# EAGLE design Updated_Schematic_11-13 (EAGLE 9.5.1)
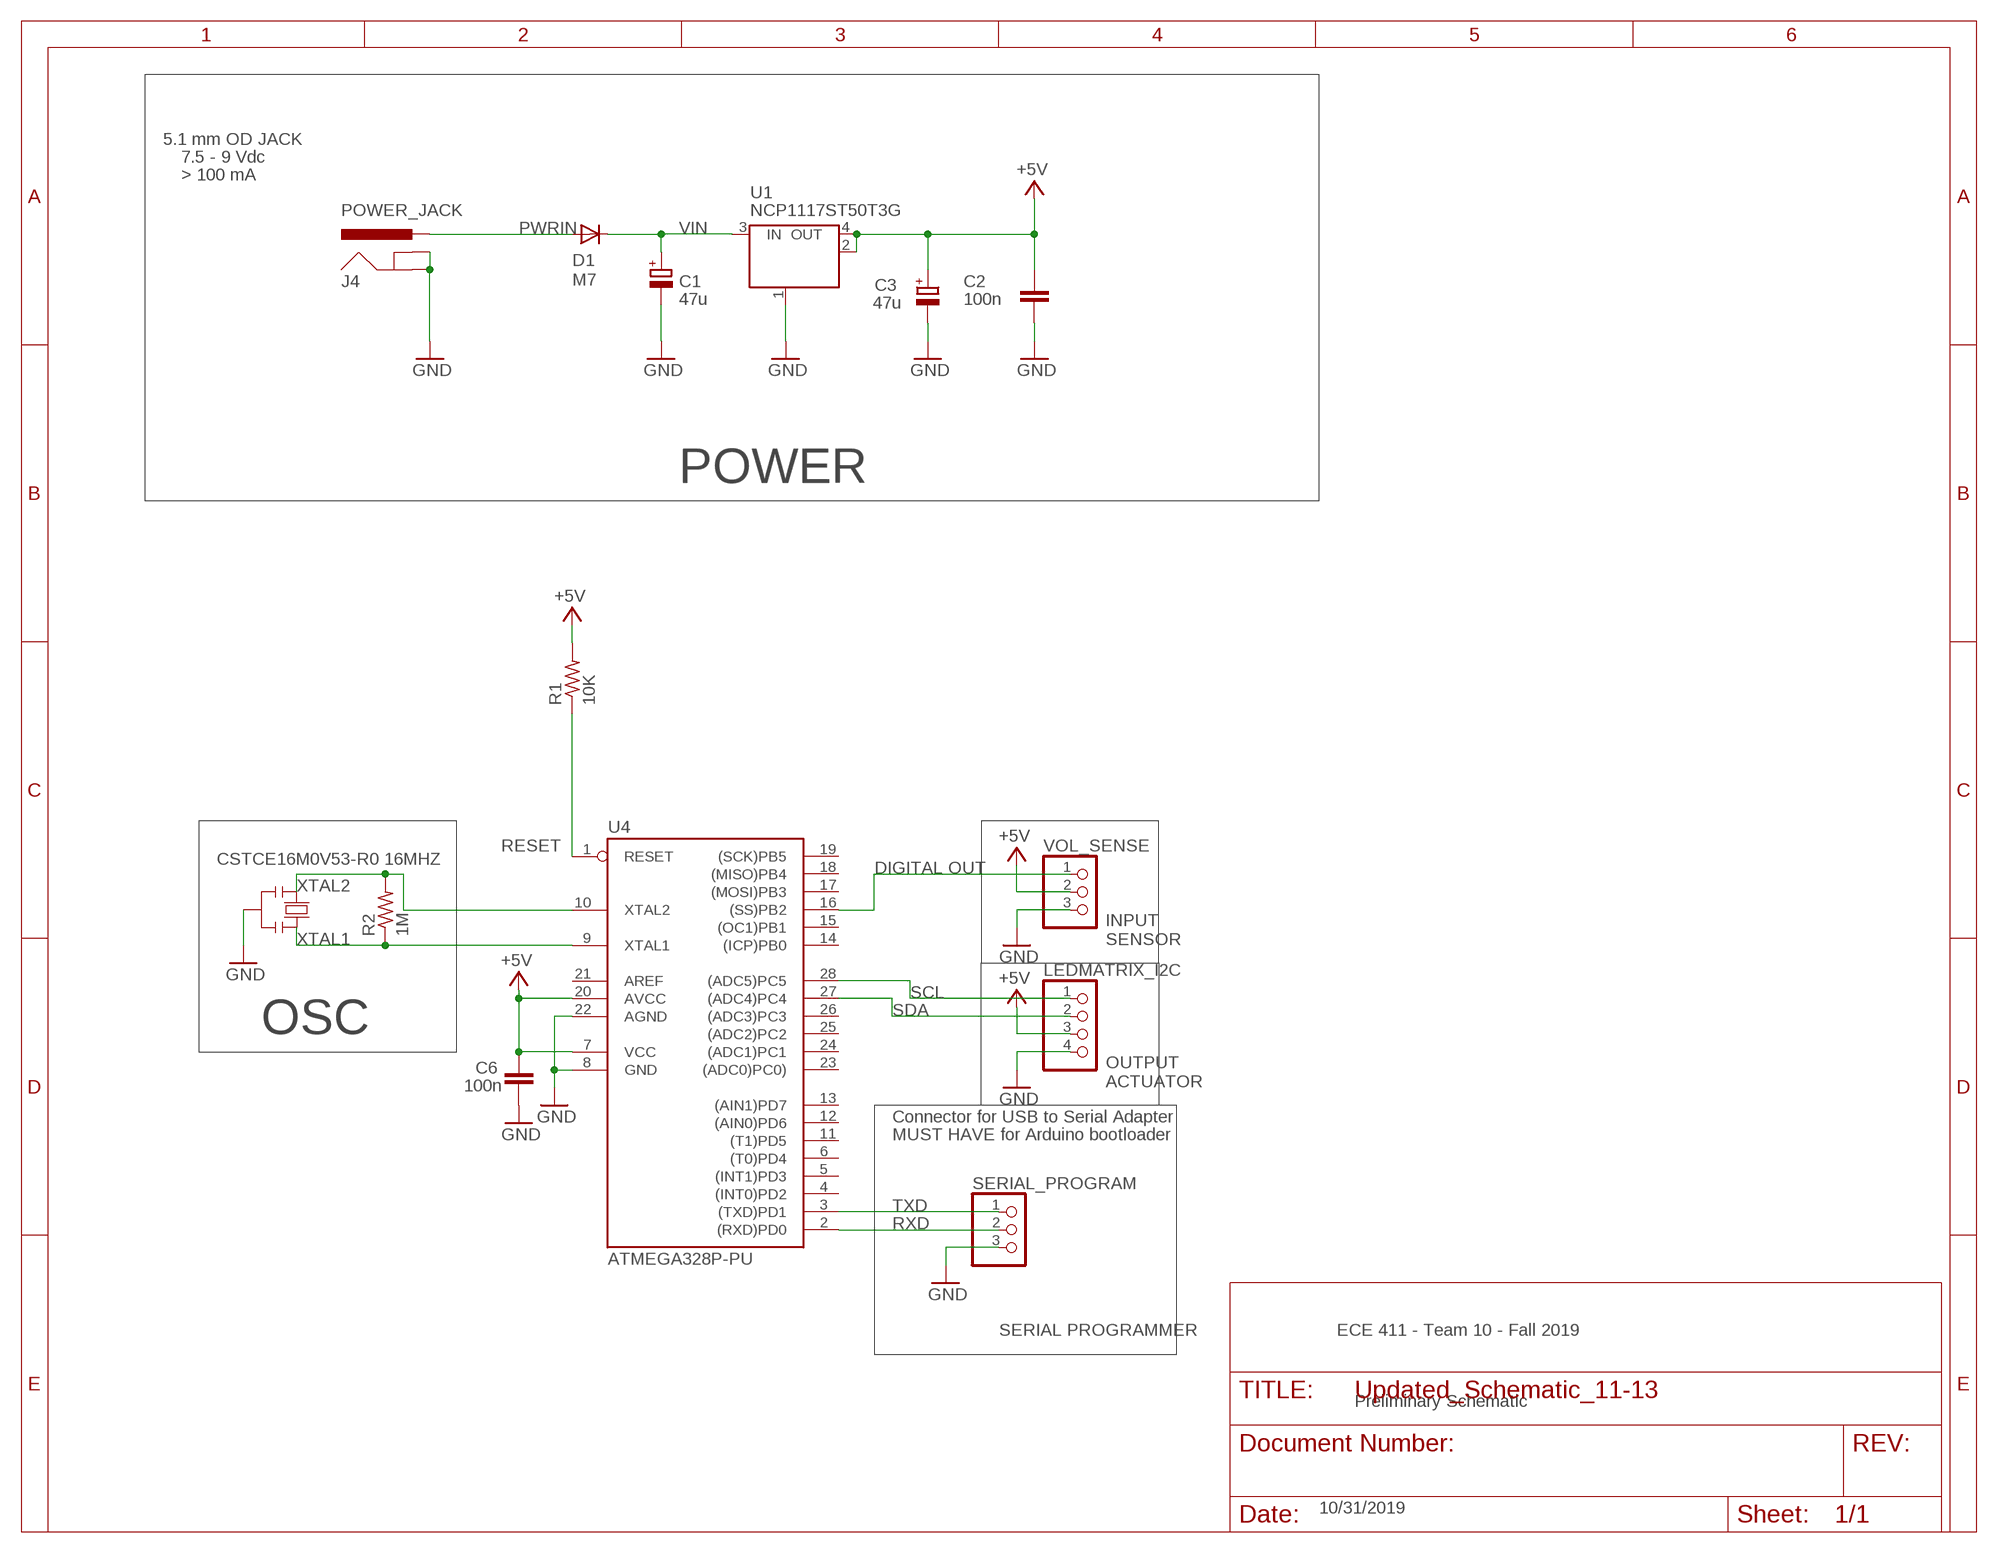
[diagram p0: schematic, sheet 1]

## Parts
C1  47u  CPOL-EUD  [PANASONIC_D]
C2  100n  C-EUC0805  [C0805]
C3  47u  CPOL-EUD  [PANASONIC_D]
C6  100n  C-EUC0805  [C0805]
D1  M7  DIODE-SMB  [SMB]
J4  POWER_JACK  [POWER_JACK_PTH]
LEDMATRIX_I2C  PINHD-1X4  [1X04]
R1  10K  R-US_R0805  [R0805]
R2  1M  R-US_R0805  [R0805]
SERIAL_PROGRAM  PINHD-1X3  [1X03]
U1  NCP1117ST50T3G  MC33269ST-3.3T3  [SOT223]
U4  ATMEGA328P-PU  [DIL28-3]
VOL_SENSE  PINHD-1X3  [1X03]
X1  CSTCE16M0V53-R0 16MHZ  RESONATORMU  [RESONATOR]

## Nets
+5V [usbvcc]: C2.2 C3.+ C6.2 LEDMATRIX_I2C.3 R1.2 U1.2(OUT) U1.4(OUT) U4.7(VCC) U4.20(AVCC) VOL_SENSE.2
GND [gnd]: C1.- C2.1 C3.- C6.1 J4.GND J4.GNDBREAK LEDMATRIX_I2C.4 SERIAL_PROGRAM.3 U1.1(GND/ADJ) U4.8(GND) U4.22(AGND) VOL_SENSE.3 X1.2
N$3: U4.16((SS)PB2) VOL_SENSE.1
PWRIN [power]: D1.A J4.PWR
RESET: R1.1 U4.1(RESET)
RXD: SERIAL_PROGRAM.2 U4.2((RXD)PD0)
SCL: LEDMATRIX_I2C.1 U4.28((ADC5)PC5)
SDA: LEDMATRIX_I2C.2 U4.27((ADC4)PC4)
TXD: SERIAL_PROGRAM.1 U4.3((TXD)PD1)
VIN [power]: C1.+ D1.C U1.3(IN)
XTAL1: R2.1 U4.9(XTAL1) X1.3
XTAL2: R2.2 U4.10(XTAL2) X1.1
Unconnected: U4.4((INT0)PD2) U4.5((INT1)PD3) U4.6((T0)PD4) U4.11((T1)PD5) U4.12((AIN0)PD6) U4.13((AIN1)PD7) U4.14((ICP)PB0) U4.15((OC1)PB1) U4.17((MOSI)PB3) U4.18((MISO)PB4) U4.19((SCK)PB5) U4.21(AREF) U4.23((ADC0)PC0)) U4.24((ADC1)PC1) U4.25((ADC2)PC2) U4.26((ADC3)PC3)

## Notes on the sheet
- 5.1 mm OD JACK
- 7.5 - 9 Vdc
- > 100 mA
- POWER
- DIGITAL OUT
- INPUT 
  SENSOR
- OSC
- OUTPUT
  ACTUATOR
- Connector for USB to Serial Adapter
- MUST HAVE for Arduino bootloader
- SERIAL PROGRAMMER | ECE 411 - Team 10 - Fall 2019
- Preliminary Schematic
- 10/31/2019

## Library data of the parts
C1 C3 = rcl:CPOL-EU: POLARIZED CAPACITOR, European symbol
C2 C6 = rcl:C-EU: CAPACITOR, European symbol
D1 = diode:DIODE-: DIODE
J4 = SparkFun-Connectors:POWER_JACK: Power Jack Connector This is the standard 5.5mm barrel jack for power. The PTH is the most common, proven, reliable, footprint. The Slot footprint only works if the mill layer is transmitted to the PCB fab house so be warned. Here are the connectors we sell at SparkFun: DC Barrel Power Jack/Connector <https://www.sparkfun.com/products/119> (PRT-00119) DC Barrel Power Jack/Connector (SMD) <https://www.sparkfun.com/products/12748> (PRT-12748) DC Barrel Jack Adapter - Breadboard Compatible <https://www.sparkfun.com/products/10811> (PRT-10811) It is used on this SparkFun product (and many, many others): SparkFun RedBoard - Programmed with Arduino <https://www.sparkfun.com/products/12757> (DEV-12757) Also, if you need a mating power supply or connector, please check these out: Wall Adapter Power Supply - 9VDC 650mA <https://www.sparkfun.com/products/298> (TOL-00298) DC Barrel Jack Adapter - Male <https://www.sparkfun.com/products/10287> (PRT-10287); PROD_ID: CONN-08197
LEDMATRIX_I2C = pinhead:PINHD-1X4: PIN HEADER
R1 R2 = rcl:R-US_: RESISTOR, American symbol
SERIAL_PROGRAM VOL_SENSE = pinhead:PINHD-1X3: PIN HEADER
U1 = linear:MC33269ST*: Adjustable Output Low Dropout Voltage Regulator 800 mA Source: http://www.onsemi.com/pub/Collateral/MC33269-D.PDF
U4 = SmartPrj:ATMEGA328P-: MICROCONTROLLER 4 Kbytes FLASH 128 bytes SRAM 256 bytes EEPROM UART 6-channel 10 bit ADC
X1 = SmartPrj:RESONATOR

## Net classes
0 default: width 0.254 mm, clearance 0.254 mm
1 power: width 0.61 mm, drill 0.61 mm, clearance 0.254 mm
2 gnd: width 0.305 mm, drill 0.559 mm, clearance 0.254 mm
3 usbvcc: width 0.508 mm, drill 0.61 mm, clearance 0.254 mm
4 aref: width 0.406 mm, drill 0.61 mm, clearance 0.254 mm

## Board
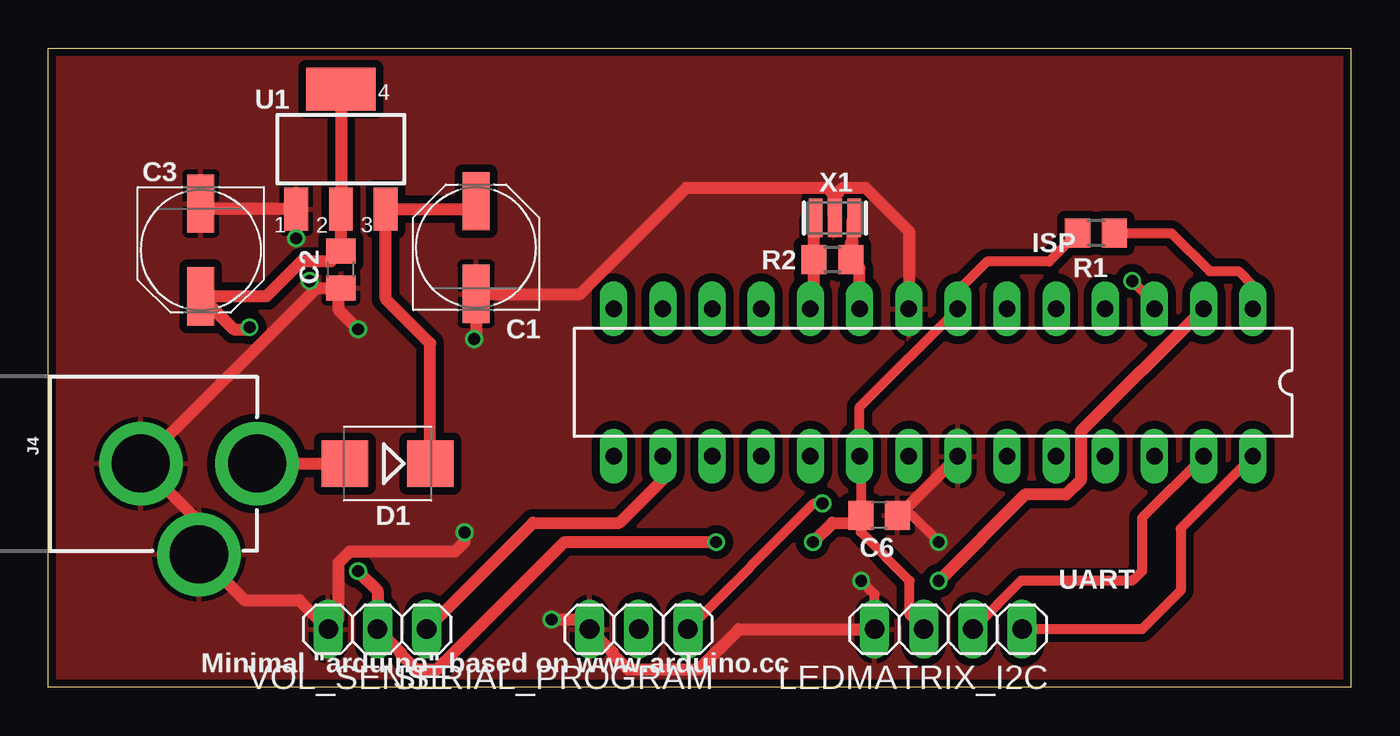
[diagram p1: board, top side]
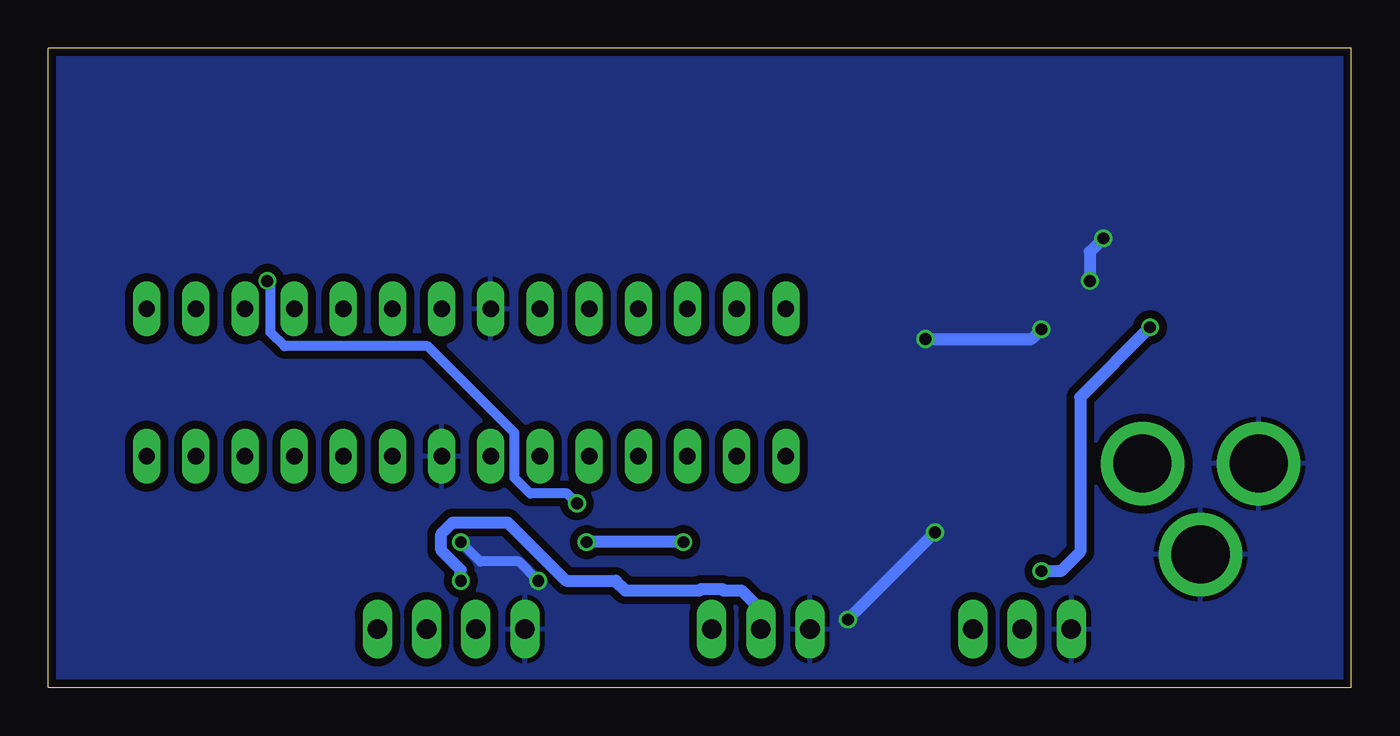
[diagram p2: board, bottom side, seen from below]

Size 67.31 x 33.02 mm. Coordinates in mm from the lower left corner, seen from the top.
Outline: 0,0 0,33.02 67.31,33.02 67.31,0 0,0
Copper layers (1*16): Top 0.035559375mm / dielectric 1.6mm / Bottom 0.035559375mm
Design rules "oshpark-2layer": minimum track width 6mil, minimum drill 10mil, track to track 6mil, track to pad 6mil, pad to pad 6mil, via to via 6mil, smd to smd 6mil, copper to edge 15mil, drill to drill 6mil, minimum pad ring 5mil, minimum via ring 5mil, stop-mask expansion 2.5mil, vias tented up to drill 0mil, thermal gap 10mil

### Footprints (pad centres in the part's own frame; a part is rotated, then mirrored left to right if it is on the bottom)
PANASONIC_D = smd 3 x 1.4: + 2.4,0; - -2.4,0
C0805 = smd 1.3 x 1.5: 1 -0.95,0; 2 0.95,0
SMB = smd 2.4 x 2.4: A 2.2,0; C -2.2,0
POWER_JACK_PTH = drill 2.997 pad 4.318: GND 0,7.7; GNDBREAK 4.7,10.7; PWR 0,13.7
1X04 = drill 1.016 long: 1 -3.81,0; 2 -1.27,0; 3 1.27,0; 4 3.81,0
R0805 = smd 1.3 x 1.5: 1 -0.95,0; 2 0.95,0
1X03 = drill 1.016 long: 1 -2.54,0; 2 0,0; 3 2.54,0
SOT223 = smd 1.219 x 2.235: 1 -2.311,-3.099; 2 0,-3.099; 3 2.311,-3.099 | smd 3.6 x 2.2: 4 0,3.099
DIL28-3 = drill 0.85 pad 1.422 long: 1 -16.51,-3.81; 2 -13.97,-3.81; 3 -11.43,-3.81; 4 -8.89,-3.81; 5 -6.35,-3.81; 6 -3.81,-3.81; 7 -1.27,-3.81; 8 1.27,-3.81; 9 3.81,-3.81; 10 6.35,-3.81; 11 8.89,-3.81; 12 11.43,-3.81; 13 13.97,-3.81; 14 16.51,-3.81; 15 16.51,3.81; 16 13.97,3.81; 17 11.43,3.81; 18 8.89,3.81; 19 6.35,3.81; 20 3.81,3.81; 21 1.27,3.81; 22 -1.27,3.81; 23 -3.81,3.81; 24 -6.35,3.81; 25 -8.89,3.81; 26 -11.43,3.81; 27 -13.97,3.81; 28 -16.51,3.81
RESONATOR = smd 0.7 x 2: 1 -1,0; 2 0,0; 3 1,0

### Placement (x,y rotation side)
C1  22.1,22.73 90 top
C2  15.11,21.59 90 top
C3  7.87,22.61 270 top
C6  42.93,8.89 180 top
D1  17.53,11.56 180 top
J4  -2.92,11.56 270 top
LEDMATRIX_I2C  46.5,3 180 top
R1  54.13,23.47 180 top
R2  40.51,22.1 180 top
SERIAL_PROGRAM  30.5,3 180 top
U1  15.11,27.81 0 top
U4  45.72,15.75 180 top
VOL_SENSE  17,3 180 top
X1  40.64,24.26 0 top

### Tracks (layer width: path | path; a pad name or v marks a point on that pad's centre or on a via)
+5V  (via drill 0.61)
  Top 0.508: R1.2 51.7,22 48.5,22 46.99,20.49 U4.7 41.91,14.48 U4.20 41.98,11.87 C6.2 41.98,8.5 41.98,8.02 44.5,5.5 44.5,3.73 LEDMATRIX_I2C.3
  Top 0.61: U1.4 15.11,25.61 15,25.5 15,24.83 U1.2 C2.2 14.59,22.02 13.08,22.02 11.27,20.21 C3.+ 9.58,18.5 10.29,18.5 v10.39,18.61 | v16,6 17,5 VOL_SENSE.2 18.22,1.78 18.22,1.69 18.99,0.92 20.09,0.92 26.67,7.5 v34.5,7.5 | v39.5,7.5 40.5,8.5 41.98,8.5
  Bottom 0.61: v10.39,18.61 14,15 14,7 15,6 v16,6 | v34.5,7.5 v39.5,7.5
GND  (via drill 0.61)
  Top 0.508: LEDMATRIX_I2C.4 42.69,4.81 v42,5.5 | v46,7.5 44.61,8.89 C6.1
  Top 0.61: C3.- 8.17,24.71 U1.1 v12.8,23.2 | v13.5,21 13.86,20.64 | 13.86,20.64 J4.GND 7.78,8.56 J4.GNDBREAK 10.14,4.5 12.96,4.5 VOL_SENSE.3 14.98,3.52 14.98,6.42 15.58,7.02 21.02,7.02 21.5,7.5 v21.5,8 | 13.86,20.64 15,20.64 | 15,20.64 C2.1 | v26,3.5 27.46,3.5 SERIAL_PROGRAM.3 29.18,1.78 29.18,1.69 29.95,0.92 33.59,0.92 35.67,3 LEDMATRIX_I2C.4 | X1.2 40.69,24.3 | 40.69,24.3 40.69,25.44 41.06,25.82 42.22,25.82 44.45,23.59 U4.8 | v22,18 22.1,18.1 C1.- 27.48,20.33 32.96,25.82 40.22,25.82 40.55,25.49 40.55,24.44 40.69,24.3 | v16,18.5 15,19.5 15,20.64 | C6.1 43.94,8.89 U4.22
  Bottom 0.508: v42,5.5 43,6.5 45,6.5 v46,7.5
  Bottom 0.61: v13.5,21 13.5,22.5 v12.8,23.2 | v21.5,8 v26,3.5 | v22,18 16.5,18 v16,18.5
  pour Bottom (isolate 0.406, rank 2): 0,33.02 67.06,33.02 67.31,32.77 67.31,0 0.25,0 0,0.25
  pour Top (isolate 0.406, rank 2): 0,33.02 67.31,33.02 67.31,0 0,0 -0.13,29.84
N$3
  Top 0.61: VOL_SENSE.1 25.04,8.5 29.5,8.5 31.75,10.75 U4.16
PWRIN
  Top 0.61: J4.PWR D1.A
RESET
  Top 0.508: R1.1 58.03,23.47 60,21.5 61.5,21.5 62.23,20.77 U4.1
RXD  (via drill 0.61)
  Top 0.61: U4.2 53.34,13.21 53.34,10.7 52.6,9.96 50.46,9.96 v46,5.5
  Bottom 0.61: v46,5.5 46,6.06 47.02,7.08 47.02,7.92 46.42,8.52 43.58,8.52 40.56,5.5 38,5.5 37.5,5 33.67,5 33.59,5.08 32.49,5.08 32.41,5 31.5,5 30.5,4 SERIAL_PROGRAM.2
SCL
  Top 0.508: U4.28 58.5,8.21 58.5,5 56.5,3 LEDMATRIX_I2C.1
SDA
  Top 0.508: U4.27 56.5,8.75 56.5,6 56,5.5 50.25,5.5 49.04,4.29 49.04,4.27 LEDMATRIX_I2C.2
TXD  (via drill 0.61)
  Top 0.508: SERIAL_PROGRAM.1 39.54,9.5 v40,9.5 | v56,21 57.15,19.85 U4.3
  Bottom 0.508: v40,9.5 40.51,10.01 42.41,10.01 43.23,10.82 43.23,13.15 47.7,17.63 55.12,17.63 55.83,18.34 55.83,20.83 v56,21
VIN
  Top 0.61: D1.C 19.73,17.77 17.42,20.08 U1.3 21.68,24.71 C1.+
XTAL1
  Top 0.61: U4.9 41.91,21.65 R2.1 41.46,22.94 41.55,23.03 41.55,24.17 X1.3
XTAL2
  Top 0.61: U4.10 39.56,19.75 R2.2 39.56,23.44 39.5,23.5 39.5,24.12 X1.1

### Text on the board
tPlace: ISP | UART
tNames: Minimal "arduino" based on www.arduino.cc
214bmp: D:/SmartProjects/Snc/a4_bn_logo2.bmp